# Altium schematic sheet TOP_SCH.SchDoc: Top Connections
size A4; Author: **; CompanyName: Electrónica Aplicada al Automotor; Organization: UTN FRBA; DocumentNumber: 1; Revision: 00; SheetNumber: 1; SheetTotal: 7; Autor: Badenas, Francisco J. / Ipar, Eugenia
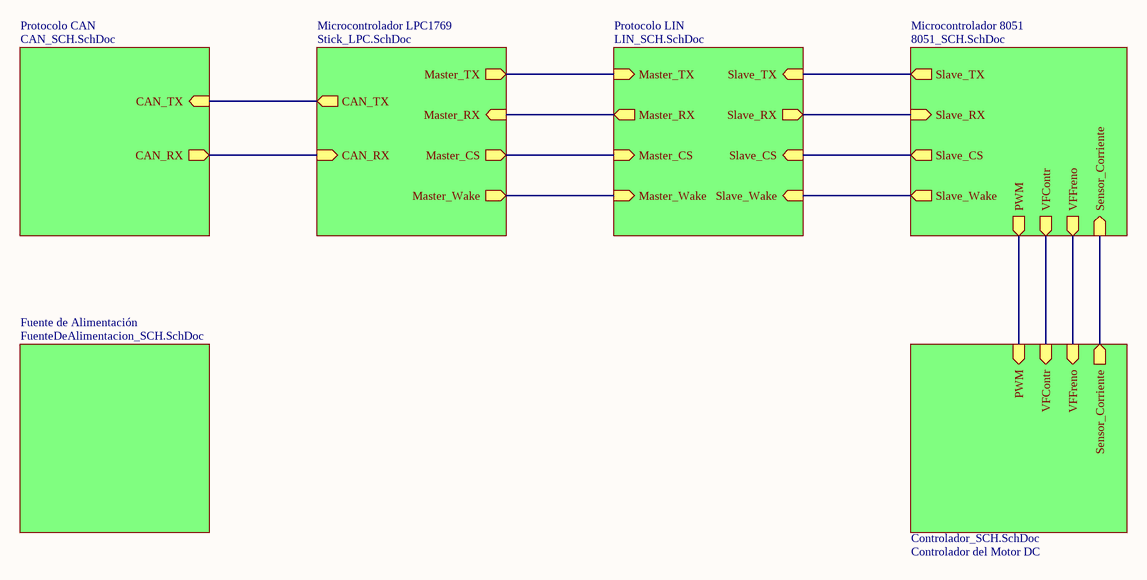
[diagram p0: TOP_SCH.SchDoc]

## Sub-sheets
Controlador del Motor DC = Controlador_SCH.SchDoc: Sensor_Corriente (out), VFFreno (in), VFContr (in), PWM (in)
Fuente de Alimentación = FuenteDeAlimentacion_SCH.SchDoc: no entries
Microcontrolador 8051 = 8051_SCH.SchDoc: Slave_TX (out), Slave_RX (in), Slave_CS (out), Slave_Wake (out), PWM (out), VFContr (out), VFFreno (out), Sensor_Corriente (in)
Microcontrolador LPC1769 = Stick_LPC.SchDoc: CAN_TX (out), CAN_RX (in), Master_TX (out), Master_RX (in), Master_CS (out), Master_Wake (out)
Protocolo CAN = CAN_SCH.SchDoc: CAN_TX (in), CAN_RX (out)
Protocolo LIN = LIN_SCH.SchDoc: Master_TX (in), Master_RX (out), Master_CS (in), Master_Wake (in), Slave_TX (in), Slave_RX (out), Slave_CS (in), Slave_Wake (in)

## Nets
(unnamed): sheet Protocolo CAN/CAN_TX, sheet Microcontrolador LPC1769/CAN_TX
(unnamed): sheet Protocolo CAN/CAN_RX, sheet Microcontrolador LPC1769/CAN_RX
(unnamed): sheet Microcontrolador LPC1769/Master_TX, sheet Protocolo LIN/Master_TX
(unnamed): sheet Microcontrolador LPC1769/Master_RX, sheet Protocolo LIN/Master_RX
(unnamed): sheet Microcontrolador LPC1769/Master_CS, sheet Protocolo LIN/Master_CS
(unnamed): sheet Microcontrolador LPC1769/Master_Wake, sheet Protocolo LIN/Master_Wake
(unnamed): sheet Protocolo LIN/Slave_TX, sheet Microcontrolador 8051/Slave_TX
(unnamed): sheet Protocolo LIN/Slave_RX, sheet Microcontrolador 8051/Slave_RX
(unnamed): sheet Protocolo LIN/Slave_CS, sheet Microcontrolador 8051/Slave_CS
(unnamed): sheet Protocolo LIN/Slave_Wake, sheet Microcontrolador 8051/Slave_Wake
(unnamed): sheet Microcontrolador 8051/PWM, sheet Controlador del Motor DC/PWM
(unnamed): sheet Microcontrolador 8051/VFContr, sheet Controlador del Motor DC/VFContr
(unnamed): sheet Microcontrolador 8051/VFFreno, sheet Controlador del Motor DC/VFFreno
(unnamed): sheet Microcontrolador 8051/Sensor_Corriente, sheet Controlador del Motor DC/Sensor_Corriente

## Notes on the sheet
- Title:
- Size:
- Author:
- A4
- Sheet
- of
- Revision:
- File:
- Date: